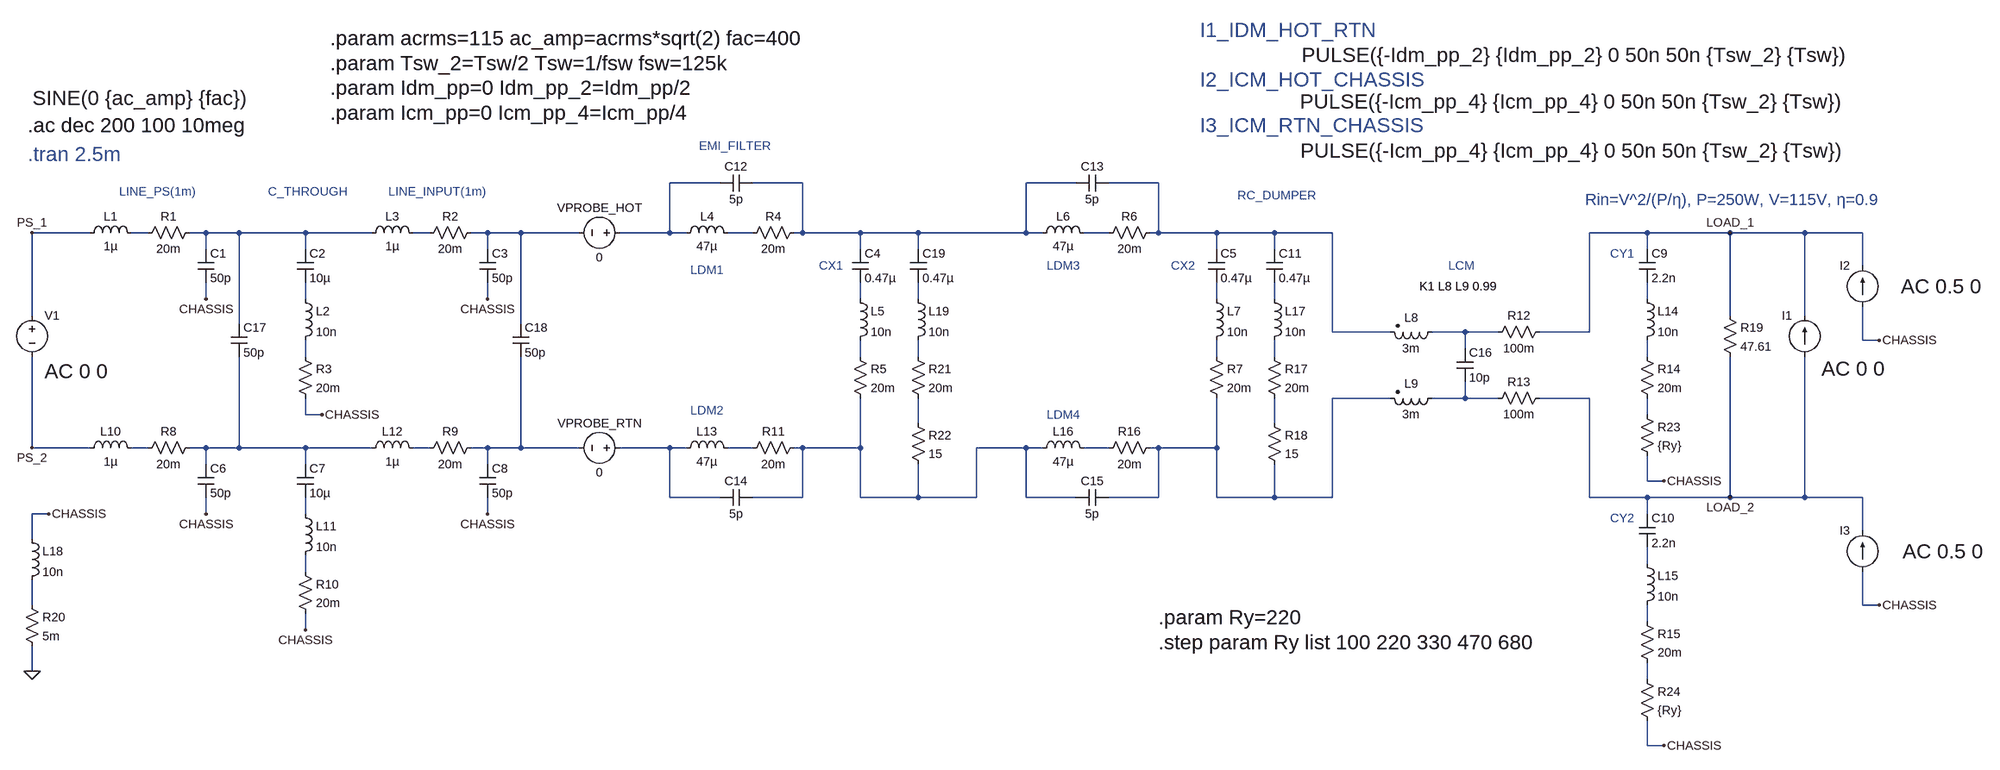
[diagram p0: schematic 461C_FILTER.asc]
461C_FILTER.asc, the LTspice schematic file:
Version 4.1
SHEET 1 4016 1116
WIRE 704 -48 608 -48
WIRE 864 -48 768 -48
WIRE 1392 -48 1296 -48
WIRE 1552 -48 1456 -48
WIRE -512 48 -624 48
WIRE -400 48 -432 48
WIRE -288 48 -320 48
WIRE -224 48 -288 48
WIRE -96 48 -224 48
WIRE 32 48 -96 48
WIRE 144 48 112 48
WIRE 256 48 224 48
WIRE 320 48 256 48
WIRE 432 48 320 48
WIRE 608 48 608 -48
WIRE 608 48 512 48
WIRE 640 48 608 48
WIRE 768 48 720 48
WIRE 864 48 864 -48
WIRE 864 48 848 48
WIRE 976 48 864 48
WIRE 1088 48 976 48
WIRE 1296 48 1296 -48
WIRE 1296 48 1088 48
WIRE 1328 48 1296 48
WIRE 1456 48 1408 48
WIRE 1552 48 1552 -48
WIRE 1552 48 1536 48
WIRE 1664 48 1552 48
WIRE 1776 48 1664 48
WIRE 1888 48 1776 48
WIRE 2496 48 2384 48
WIRE 2656 48 2496 48
WIRE 2800 48 2656 48
WIRE 2912 48 2800 48
WIRE -288 80 -288 48
WIRE -96 80 -96 48
WIRE 256 80 256 48
WIRE 976 80 976 48
WIRE 1088 80 1088 48
WIRE 1664 80 1664 48
WIRE 1776 80 1776 48
WIRE 2496 80 2496 48
WIRE 2912 112 2912 48
WIRE -288 176 -288 144
WIRE -96 176 -96 144
WIRE 256 176 256 144
WIRE 976 176 976 144
WIRE 1088 176 1088 144
WIRE 1664 176 1664 144
WIRE 1776 176 1776 144
WIRE 2496 176 2496 144
WIRE -624 208 -624 48
WIRE 2656 208 2656 48
WIRE 2800 208 2800 48
WIRE -224 224 -224 48
WIRE 320 224 320 48
WIRE 1888 240 1888 48
WIRE 2000 240 1888 240
WIRE 2144 240 2080 240
WIRE 2208 240 2144 240
WIRE 2384 240 2384 48
WIRE 2384 240 2288 240
WIRE 2912 256 2912 192
WIRE 2944 256 2912 256
WIRE 2144 272 2144 240
WIRE -96 288 -96 256
WIRE 976 288 976 256
WIRE 1088 288 1088 256
WIRE 1664 288 1664 256
WIRE 1776 288 1776 256
WIRE 2496 288 2496 256
WIRE 2000 368 1888 368
WIRE 2144 368 2144 336
WIRE 2144 368 2080 368
WIRE 2208 368 2144 368
WIRE 2384 368 2288 368
WIRE -96 400 -96 368
WIRE -64 400 -96 400
WIRE 2496 400 2496 368
WIRE 1088 416 1088 368
WIRE 1776 416 1776 368
WIRE -624 464 -624 288
WIRE -512 464 -624 464
WIRE -400 464 -432 464
WIRE -288 464 -320 464
WIRE -224 464 -224 288
WIRE -224 464 -288 464
WIRE -96 464 -224 464
WIRE 32 464 -96 464
WIRE 144 464 112 464
WIRE 256 464 224 464
WIRE 320 464 320 288
WIRE 320 464 256 464
WIRE 432 464 320 464
WIRE 608 464 512 464
WIRE 640 464 608 464
WIRE 768 464 720 464
WIRE 864 464 848 464
WIRE 976 464 976 368
WIRE 976 464 864 464
WIRE 1296 464 1200 464
WIRE 1328 464 1296 464
WIRE 1456 464 1408 464
WIRE 1552 464 1536 464
WIRE 1664 464 1664 368
WIRE 1664 464 1552 464
WIRE -288 496 -288 464
WIRE -96 496 -96 464
WIRE 256 496 256 464
WIRE 2496 528 2496 480
WIRE 2528 528 2496 528
WIRE 608 560 608 464
WIRE 704 560 608 560
WIRE 864 560 864 464
WIRE 864 560 768 560
WIRE 976 560 976 464
WIRE 1088 560 1088 496
WIRE 1088 560 976 560
WIRE 1200 560 1200 464
WIRE 1200 560 1088 560
WIRE 1296 560 1296 464
WIRE 1392 560 1296 560
WIRE 1552 560 1552 464
WIRE 1552 560 1456 560
WIRE 1664 560 1664 464
WIRE 1776 560 1776 496
WIRE 1776 560 1664 560
WIRE 1888 560 1888 368
WIRE 1888 560 1776 560
WIRE 2384 560 2384 368
WIRE 2496 560 2384 560
WIRE 2656 560 2656 288
WIRE 2656 560 2496 560
WIRE 2800 560 2800 288
WIRE 2800 560 2656 560
WIRE 2912 560 2800 560
WIRE -592 592 -624 592
WIRE -288 592 -288 560
WIRE -96 592 -96 560
WIRE 256 592 256 560
WIRE 2496 592 2496 560
WIRE 2912 624 2912 560
WIRE -624 640 -624 592
WIRE 2496 688 2496 656
WIRE -96 704 -96 672
WIRE -624 768 -624 720
WIRE 2912 768 2912 704
WIRE 2944 768 2912 768
WIRE 2496 800 2496 768
WIRE -96 816 -96 784
WIRE -624 896 -624 848
WIRE 2496 912 2496 880
WIRE 2496 1040 2496 992
WIRE 2528 1040 2496 1040
FLAG 2656 48 LOAD_1
FLAG 2656 560 LOAD_2
FLAG -624 48 PS_1
FLAG -624 464 PS_2
FLAG -288 176 CHASSIS
FLAG -288 592 CHASSIS
FLAG -96 816 CHASSIS
FLAG 256 176 CHASSIS
FLAG 256 592 CHASSIS
FLAG -64 400 CHASSIS
FLAG 2528 528 CHASSIS
FLAG -624 896 0
FLAG -592 592 CHASSIS
FLAG 2944 256 CHASSIS
FLAG 2944 768 CHASSIS
FLAG 2528 1040 CHASSIS
SYMBOL voltage -624 192 R0
WINDOW 123 24 124 Left 4
WINDOW 39 0 0 Left 0
WINDOW 3 1 -404 Left 4
SYMATTR Value2 AC 0 0
SYMATTR InstName V1
SYMATTR Value SINE(0 {ac_amp} {fac})
SYMBOL ind -528 64 R270
WINDOW 0 32 56 VTop 2
WINDOW 3 5 56 VBottom 2
SYMATTR InstName L1
SYMATTR Value 1µ
SYMATTR SpiceLine Rser=1m
SYMBOL res -304 32 R90
WINDOW 0 0 56 VBottom 2
WINDOW 3 32 56 VTop 2
SYMATTR InstName R1
SYMATTR Value 20m
SYMBOL cap -304 80 R0
SYMATTR InstName C1
SYMATTR Value 50p
SYMBOL cap -112 80 R0
SYMATTR InstName C2
SYMATTR Value 10µ
SYMBOL ind -112 160 R0
SYMATTR InstName L2
SYMATTR Value 10n
SYMATTR SpiceLine Rser=1m
SYMBOL ind 16 64 R270
WINDOW 0 32 56 VTop 2
WINDOW 3 5 56 VBottom 2
SYMATTR InstName L3
SYMATTR Value 1µ
SYMATTR SpiceLine Rser=1m
SYMBOL res 240 32 R90
WINDOW 0 0 56 VBottom 2
WINDOW 3 32 56 VTop 2
SYMATTR InstName R2
SYMATTR Value 20m
SYMBOL cap 240 80 R0
SYMATTR InstName C3
SYMATTR Value 50p
SYMBOL res -112 272 R0
SYMATTR InstName R3
SYMATTR Value 20m
SYMBOL ind 624 64 R270
WINDOW 0 32 56 VTop 2
WINDOW 3 5 56 VBottom 2
SYMATTR InstName L4
SYMATTR Value 47µ
SYMATTR SpiceLine Rser=1m
SYMBOL res 864 32 R90
WINDOW 0 0 56 VBottom 2
WINDOW 3 32 56 VTop 2
SYMATTR InstName R4
SYMATTR Value 20m
SYMBOL cap 960 80 R0
SYMATTR InstName C4
SYMATTR Value 0.47µ
SYMBOL ind 960 160 R0
SYMATTR InstName L5
SYMATTR Value 10n
SYMATTR SpiceLine Rser=1m
SYMBOL res 960 272 R0
SYMATTR InstName R5
SYMATTR Value 20m
SYMBOL ind 1312 64 R270
WINDOW 0 32 56 VTop 2
WINDOW 3 5 56 VBottom 2
SYMATTR InstName L6
SYMATTR Value 47µ
SYMATTR SpiceLine Rser=1m
SYMBOL res 1552 32 R90
WINDOW 0 0 56 VBottom 2
WINDOW 3 32 56 VTop 2
SYMATTR InstName R6
SYMATTR Value 20m
SYMBOL cap 1648 80 R0
SYMATTR InstName C5
SYMATTR Value 0.47µ
SYMBOL ind 1648 160 R0
SYMATTR InstName L7
SYMATTR Value 10n
SYMATTR SpiceLine Rser=1m
SYMBOL res 1648 272 R0
SYMATTR InstName R7
SYMATTR Value 20m
SYMBOL ind2 2096 224 R90
WINDOW 0 4 56 VBottom 2
WINDOW 3 32 56 VTop 2
SYMATTR InstName L8
SYMATTR Value 3m
SYMATTR SpiceLine Rser=1m
SYMBOL ind2 2096 352 R90
WINDOW 0 4 56 VBottom 2
WINDOW 3 32 56 VTop 2
SYMATTR InstName L9
SYMATTR Value 3m
SYMATTR SpiceLine Rser=1m
SYMBOL ind -528 480 R270
WINDOW 0 32 56 VTop 2
WINDOW 3 5 56 VBottom 2
SYMATTR InstName L10
SYMATTR Value 1µ
SYMATTR SpiceLine Rser=1m
SYMBOL res -304 448 R90
WINDOW 0 0 56 VBottom 2
WINDOW 3 32 56 VTop 2
SYMATTR InstName R8
SYMATTR Value 20m
SYMBOL cap -304 496 R0
SYMATTR InstName C6
SYMATTR Value 50p
SYMBOL cap -112 496 R0
SYMATTR InstName C7
SYMATTR Value 10µ
SYMBOL ind -112 576 R0
SYMATTR InstName L11
SYMATTR Value 10n
SYMATTR SpiceLine Rser=1m
SYMBOL ind 16 480 R270
WINDOW 0 32 56 VTop 2
WINDOW 3 5 56 VBottom 2
SYMATTR InstName L12
SYMATTR Value 1µ
SYMATTR SpiceLine Rser=1m
SYMBOL res 240 448 R90
WINDOW 0 0 56 VBottom 2
WINDOW 3 32 56 VTop 2
SYMATTR InstName R9
SYMATTR Value 20m
SYMBOL cap 240 496 R0
SYMATTR InstName C8
SYMATTR Value 50p
SYMBOL res -112 688 R0
SYMATTR InstName R10
SYMATTR Value 20m
SYMBOL ind 624 480 R270
WINDOW 0 32 56 VTop 2
WINDOW 3 5 56 VBottom 2
SYMATTR InstName L13
SYMATTR Value 47µ
SYMATTR SpiceLine Rser=1m
SYMBOL res 864 448 R90
WINDOW 0 0 56 VBottom 2
WINDOW 3 32 56 VTop 2
SYMATTR InstName R11
SYMATTR Value 20m
SYMBOL res 2304 224 R90
WINDOW 0 0 56 VBottom 2
WINDOW 3 32 56 VTop 2
SYMATTR InstName R12
SYMATTR Value 100m
SYMBOL res 2304 352 R90
WINDOW 0 0 56 VBottom 2
WINDOW 3 32 56 VTop 2
SYMATTR InstName R13
SYMATTR Value 100m
SYMBOL cap 2480 80 R0
SYMATTR InstName C9
SYMATTR Value 2.2n
SYMBOL ind 2480 160 R0
SYMATTR InstName L14
SYMATTR Value 10n
SYMATTR SpiceLine Rser=1m
SYMBOL res 2480 272 R0
SYMATTR InstName R14
SYMATTR Value 20m
SYMBOL cap 2480 592 R0
SYMATTR InstName C10
SYMATTR Value 2.2n
SYMBOL ind 2480 672 R0
SYMATTR InstName L15
SYMATTR Value 10n
SYMATTR SpiceLine Rser=1m
SYMBOL res 2480 784 R0
SYMATTR InstName R15
SYMATTR Value 20m
SYMBOL ind 1312 480 R270
WINDOW 0 32 56 VTop 2
WINDOW 3 5 56 VBottom 2
SYMATTR InstName L16
SYMATTR Value 47µ
SYMATTR SpiceLine Rser=1m
SYMBOL res 1552 448 R90
WINDOW 0 0 56 VBottom 2
WINDOW 3 32 56 VTop 2
SYMATTR InstName R16
SYMATTR Value 20m
SYMBOL cap 1760 80 R0
SYMATTR InstName C11
SYMATTR Value 0.47µ
SYMBOL ind 1760 160 R0
SYMATTR InstName L17
SYMATTR Value 10n
SYMATTR SpiceLine Rser=1m
SYMBOL res 1760 272 R0
SYMATTR InstName R17
SYMATTR Value 20m
SYMBOL res 1760 400 R0
SYMATTR InstName R18
SYMATTR Value 15
SYMBOL res 2640 192 R0
SYMATTR InstName R19
SYMATTR Value 47.61
SYMBOL cap 768 -64 R90
WINDOW 0 0 32 VBottom 2
WINDOW 3 32 32 VTop 2
SYMATTR InstName C12
SYMATTR Value 5p
SYMBOL cap 1456 -64 R90
WINDOW 0 0 32 VBottom 2
WINDOW 3 32 32 VTop 2
SYMATTR InstName C13
SYMATTR Value 5p
SYMBOL cap 768 544 R90
WINDOW 0 0 32 VBottom 2
WINDOW 3 32 32 VTop 2
SYMATTR InstName C14
SYMATTR Value 5p
SYMBOL cap 1456 544 R90
WINDOW 0 0 32 VBottom 2
WINDOW 3 32 32 VTop 2
SYMATTR InstName C15
SYMATTR Value 5p
SYMBOL cap 2128 272 R0
SYMATTR InstName C16
SYMATTR Value 10p
SYMBOL cap -240 224 R0
SYMATTR InstName C17
SYMATTR Value 50p
SYMBOL cap 304 224 R0
SYMATTR InstName C18
SYMATTR Value 50p
SYMBOL ind -640 624 R0
SYMATTR InstName L18
SYMATTR Value 10n
SYMATTR SpiceLine Rser=1m
SYMBOL res -640 752 R0
SYMATTR InstName R20
SYMATTR Value 5m
SYMBOL cap 1072 80 R0
SYMATTR InstName C19
SYMATTR Value 0.47µ
SYMBOL ind 1072 160 R0
SYMATTR InstName L19
SYMATTR Value 10n
SYMATTR SpiceLine Rser=1m
SYMBOL res 1072 272 R0
SYMATTR InstName R21
SYMATTR Value 20m
SYMBOL res 1072 400 R0
SYMATTR InstName R22
SYMATTR Value 15
SYMBOL voltage 528 48 R90
WINDOW 0 -32 56 VBottom 2
WINDOW 3 32 56 VTop 2
WINDOW 123 0 0 Left 0
WINDOW 39 0 0 Left 0
SYMATTR InstName VPROBE_HOT
SYMATTR Value 0
SYMBOL voltage 528 464 R90
WINDOW 0 -32 56 VBottom 2
WINDOW 3 32 56 VTop 2
WINDOW 123 0 0 Left 0
WINDOW 39 0 0 Left 0
SYMATTR InstName VPROBE_RTN
SYMATTR Value 0
SYMBOL current 2800 288 R180
WINDOW 0 24 80 Left 2
WINDOW 3 -87 584 Left 4
WINDOW 123 -155 -23 Left 4
WINDOW 39 0 0 Left 0
SYMATTR InstName I1
SYMATTR Value PULSE({-Idm_pp_2} {Idm_pp_2} 0 50n 50n {Tsw_2} {Tsw})
SYMATTR Value2 AC 0 0
SYMBOL current 2912 192 R180
WINDOW 0 24 80 Left 2
WINDOW 3 33 398 Left 4
WINDOW 123 -230 40 Left 4
WINDOW 39 0 0 Left 0
SYMATTR InstName I2
SYMATTR Value PULSE({-Icm_pp_4} {Icm_pp_4} 0 50n 50n {Tsw_2} {Tsw})
SYMATTR Value2 AC 0.5 0
SYMBOL current 2912 704 R180
WINDOW 0 24 80 Left 2
WINDOW 3 32 815 Left 4
WINDOW 123 -234 40 Left 4
WINDOW 39 0 0 Left 0
SYMATTR InstName I3
SYMATTR Value PULSE({-Icm_pp_4} {Icm_pp_4} 0 50n 50n {Tsw_2} {Tsw})
SYMATTR Value2 AC 0.5 0
SYMBOL res 2480 384 R0
SYMATTR InstName R23
SYMATTR Value {Ry}
SYMBOL res 2480 896 R0
SYMATTR InstName R24
SYMATTR Value {Ry}
TEXT -456 -32 Left 2 ;LINE_PS(1m)
TEXT -168 -32 Left 2 ;C_THROUGH
TEXT 64 -32 Left 2 ;LINE_INPUT(1m)
TEXT 2056 152 Left 2 !K1 L8 L9 0.99
TEXT 896 112 Left 2 ;CX1
TEXT 1576 112 Left 2 ;CX2
TEXT 2424 88 Left 2 ;CY1
TEXT 2424 600 Left 2 ;CY2
TEXT 2112 112 Left 2 ;LCM
TEXT 648 120 Left 2 ;LDM1
TEXT 648 392 Left 2 ;LDM2
TEXT 1336 112 Left 2 ;LDM3
TEXT 1336 400 Left 2 ;LDM4
TEXT 1704 -24 Left 2 ;RC_DUMPER
TEXT -632 -104 Left 4 ;.tran 2.5m
TEXT -48 -328 Left 4 !.param acrms=115 ac_amp=acrms*sqrt(2) fac=400
TEXT -632 -160 Left 4 !.ac dec 200 100 10meg
TEXT 664 -120 Left 2 ;EMI_FILTER
TEXT 2376 -16 Left 3 ;Rin=V^2/(P/η), P=250W, V=115V, η=0.9
TEXT -48 -232 Left 4 !.param Idm_pp=0 Idm_pp_2=Idm_pp/2
TEXT -48 -280 Left 4 !.param Tsw_2=Tsw/2 Tsw=1/fsw fsw=125k
TEXT -48 -184 Left 4 !.param Icm_pp=0 Icm_pp_4=Icm_pp/4
TEXT 1632 -344 Left 4 ;I1_IDM_HOT_RTN
TEXT 1632 -248 Left 4 ;I2_ICM_HOT_CHASSIS
TEXT 1632 -160 Left 4 ;I3_ICM_RTN_CHASSIS
TEXT 1552 792 Left 4 !.param Ry=220
TEXT 1552 840 Left 4 !.step param Ry list 100 220 330 470 680

The netlist it stands for:
* 461C_FILTER.asc
V1 PS_1 PS_2 SINE(0 {ac_amp} {fac}) AC 0 0
L1 PS_1 N004 1µ Rser=1m
R1 N005 N004 20m
C1 N005 CHASSIS 50p
C2 N005 N010 10µ
L2 N010 N017 10n Rser=1m
L3 N005 N006 1µ Rser=1m
R2 N007 N006 20m
C3 N007 CHASSIS 50p
R3 N017 CHASSIS 20m
L4 N001 N008 47µ Rser=1m
R4 N002 N008 20m
C4 N002 N011 0.47µ
L5 N011 N018 10n Rser=1m
R5 N018 N034 20m
L6 N002 N009 47µ Rser=1m
R6 N003 N009 20m
C5 N003 N013 0.47µ
L7 N013 N020 10n Rser=1m
R7 N020 N023 20m
L8 N016 N003 3m Rser=1m
L9 N024 N023 3m Rser=1m
L10 PS_2 N028 1µ Rser=1m
R8 N029 N028 20m
C6 N029 CHASSIS 50p
C7 N029 N036 10µ
L11 N036 N038 10n Rser=1m
L12 N029 N030 1µ Rser=1m
R9 N031 N030 20m
C8 N031 CHASSIS 50p
R10 N038 CHASSIS 20m
L13 N032 N033 47µ Rser=1m
R11 N034 N033 20m
R12 LOAD_1 N016 100m
R13 LOAD_2 N024 100m
C9 LOAD_1 N015 2.2n
L14 N015 N022 10n Rser=1m
R14 N022 N025 20m
C10 LOAD_2 N037 2.2n
L15 N037 N040 10n Rser=1m
R15 N040 N041 20m
L16 N034 N035 47µ Rser=1m
R16 N023 N035 20m
C11 N003 N014 0.47µ
L17 N014 N021 10n Rser=1m
R17 N021 N027 20m
R18 N027 N023 15
R19 LOAD_1 LOAD_2 47.61
C12 N002 N001 5p
C13 N003 N002 5p
C14 N034 N032 5p
C15 N023 N034 5p
C16 N016 N024 10p
C17 N005 N029 50p
C18 N007 N031 50p
L18 CHASSIS N039 10n Rser=1m
R20 N039 0 5m
C19 N002 N012 0.47µ
L19 N012 N019 10n Rser=1m
R21 N019 N026 20m
R22 N026 N034 15
VPROBE_HOT N001 N007 0
VPROBE_RTN N032 N031 0
I1 LOAD_2 LOAD_1 PULSE({-Idm_pp_2} {Idm_pp_2} 0 50n 50n {Tsw_2} {Tsw}) AC 0 0
I2 CHASSIS LOAD_1 PULSE({-Icm_pp_4} {Icm_pp_4} 0 50n 50n {Tsw_2} {Tsw}) AC 0.5 0
I3 CHASSIS LOAD_2 PULSE({-Icm_pp_4} {Icm_pp_4} 0 50n 50n {Tsw_2} {Tsw}) AC 0.5 0
R23 N025 CHASSIS {Ry}
R24 N041 CHASSIS {Ry}
* LINE_PS(1m)
* C_THROUGH
* LINE_INPUT(1m)
K1 L8 L9 0.99
* CX1
* CX2
* CY1
* CY2
* LCM
* LDM1
* LDM2
* LDM3
* LDM4
* RC_DUMPER
* .tran 2.5m
.param acrms=115 ac_amp=acrms*sqrt(2) fac=400
.ac dec 200 100 10meg
* EMI_FILTER
* Rin=V^2/(P/η), P=250W, V=115V, η=0.9
.param Idm_pp=0 Idm_pp_2=Idm_pp/2
.param Tsw_2=Tsw/2 Tsw=1/fsw fsw=125k
.param Icm_pp=0 Icm_pp_4=Icm_pp/4
* I1_IDM_HOT_RTN
* I2_ICM_HOT_CHASSIS
* I3_ICM_RTN_CHASSIS
.param Ry=220
.step param Ry list 100 220 330 470 680
.backanno
.end